# EAGLE design MAXboard_V2 (EAGLE 9.0.0)
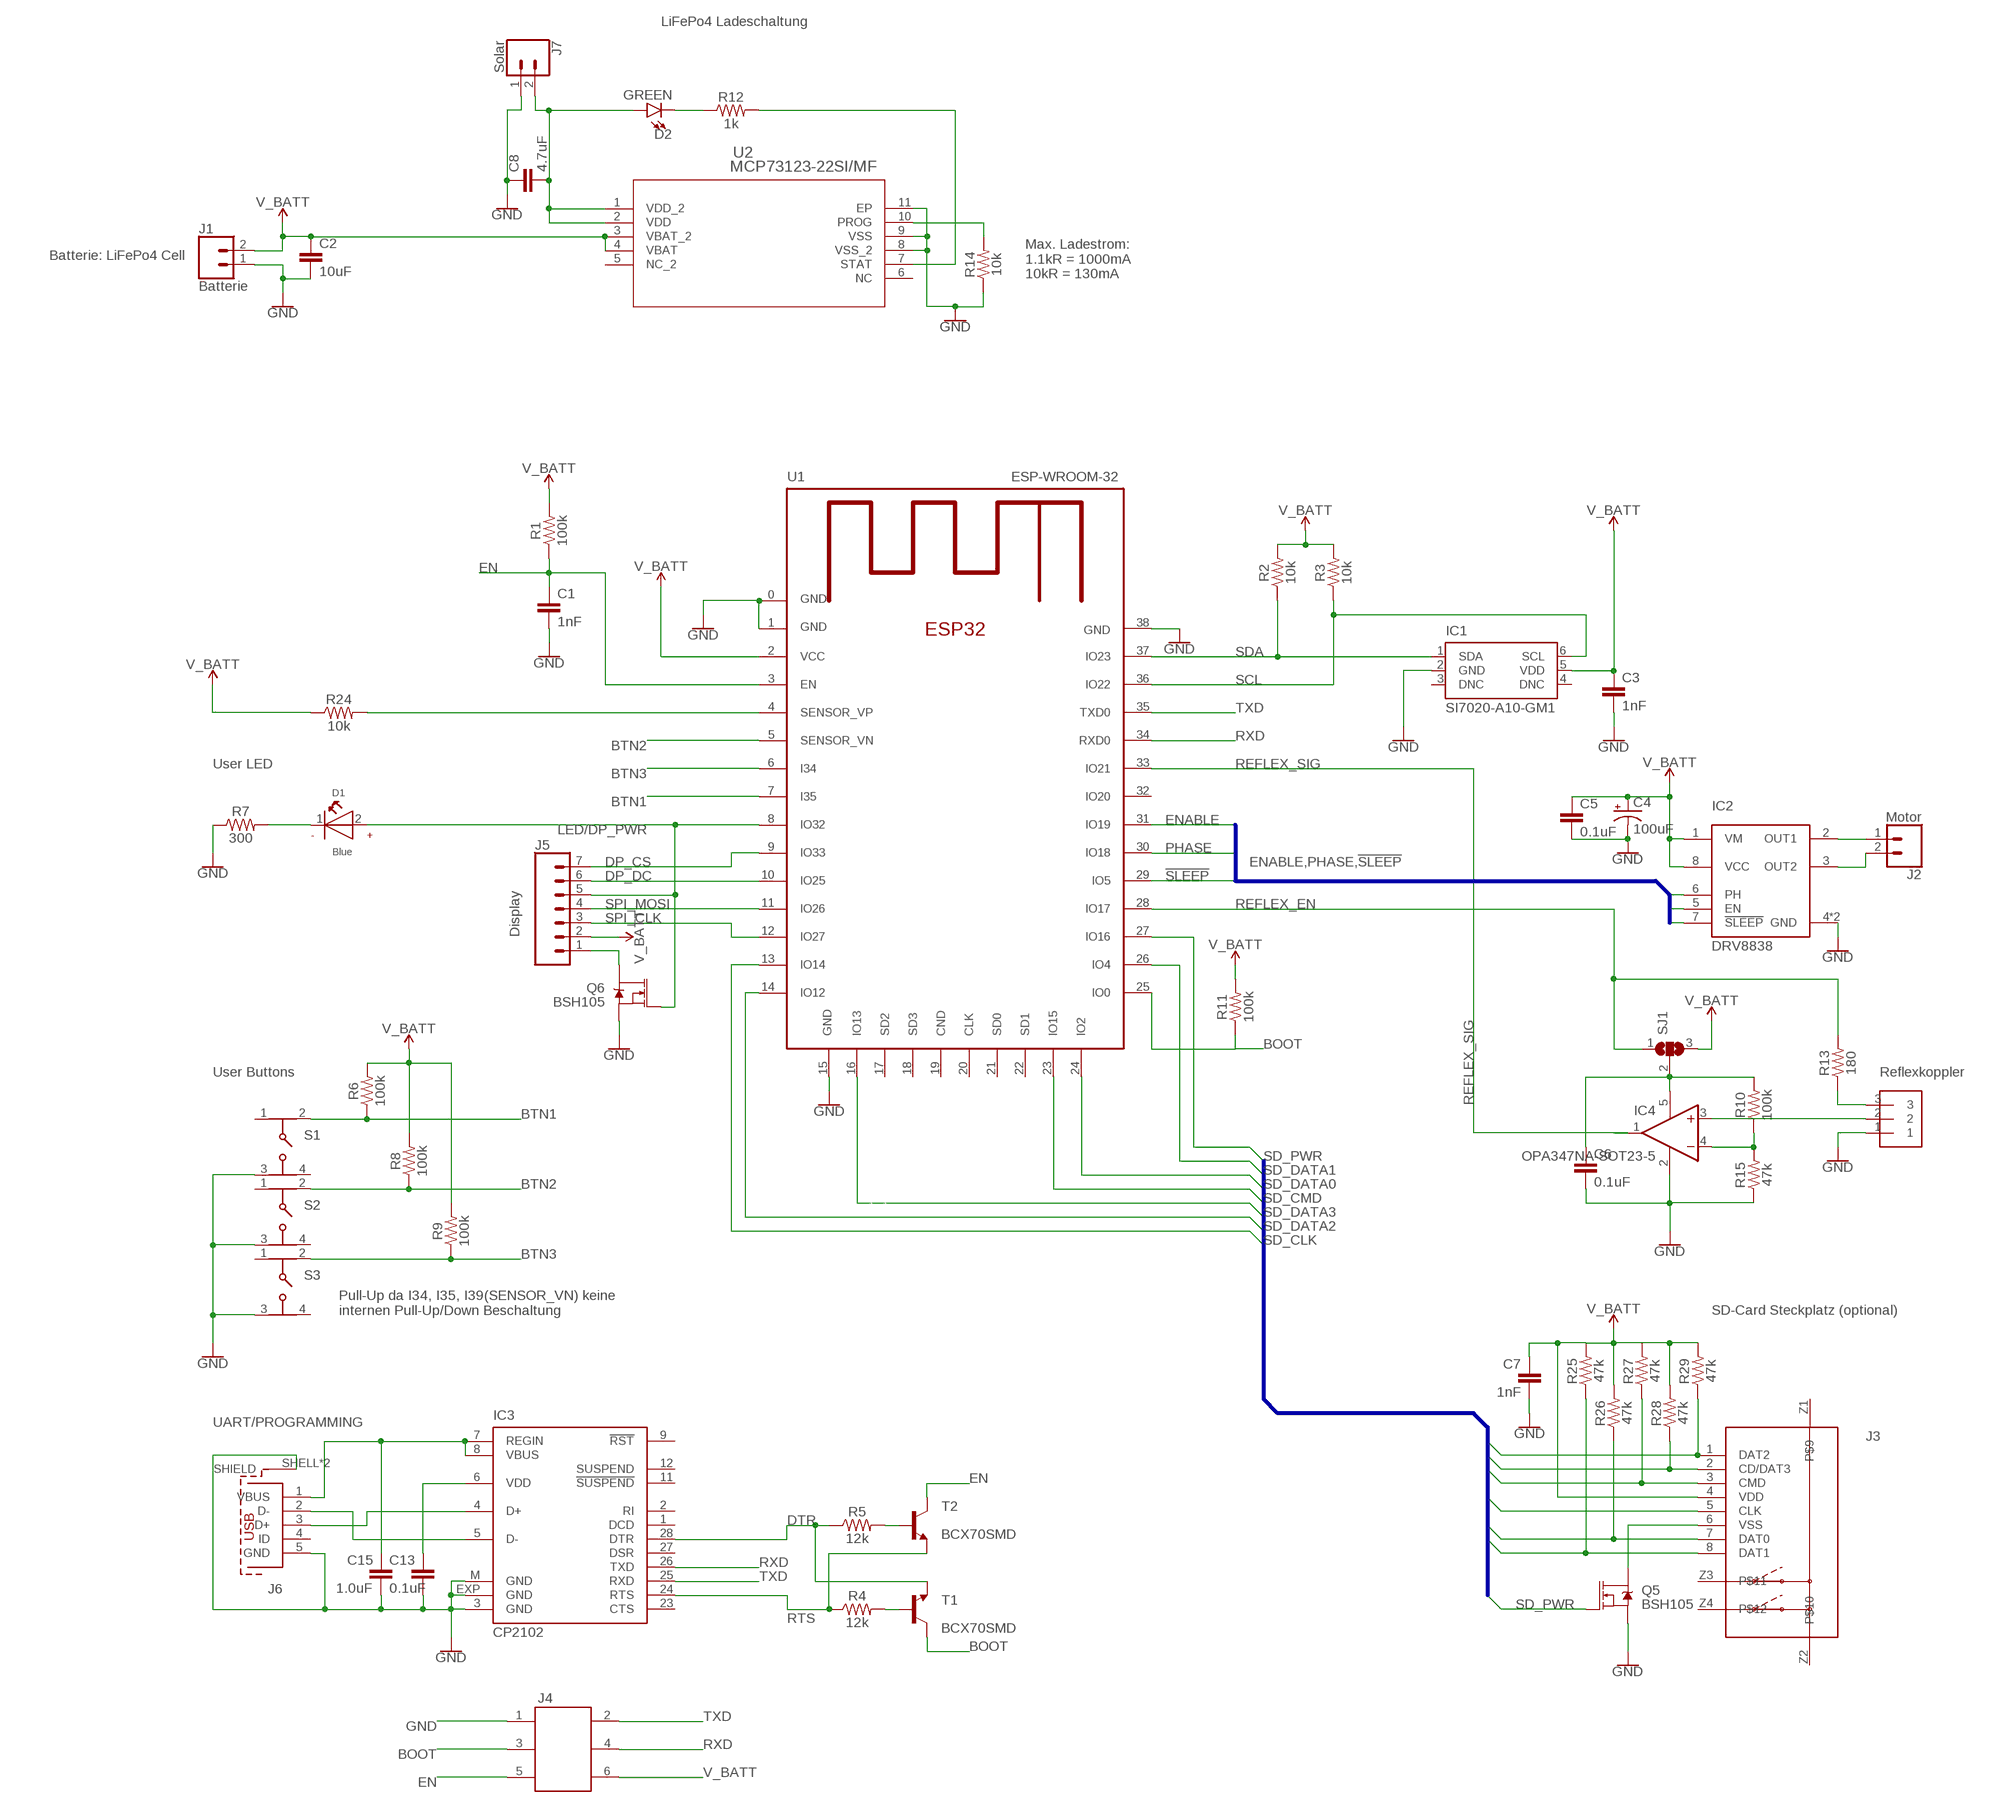
[diagram p0: schematic, sheet 1]

## Parts
C1  1nF  1.0NF/1000PF-0603-50V-10%  [0603]
C2  10uF  10UF-0603-6.3V-20%  [0603]
C3  1nF  1.0NF/1000PF-0603-50V-10%  [0603]
C4  100uF  100UF-POLAR-25V-20%(ELEC)  [PANASONIC_D]
C5  0.1uF  0.1UF-0603-25V-(+80/-20%)  [0603]
C6  0.1uF  0.1UF-0603-25V-(+80/-20%)  [0603]
C7  1nF  1.0NF/1000PF-0603-50V-10%  [0603]
C8  4.7uF  4.7UF0603  [0603]
C13  0.1uF  0.1UF-0603-25V-5%  [0603]
C15  1.0uF  1.0UF-0603-16V-10%  [0603]
D1  Blue  WL-SMCW-150060BS75000-B  [WL-SMCW_0603]
D2  GREEN  LED-GREEN0603  [LED-0603]
IC1  SI7020-A10-GM1  [DFN6-3X3]
IC2  DRV8838  [WSON8-2X2]
IC3  CP2102  [MLP28]
IC4  OPA347NA-SOT23-5  OPA344N-SOT23  [SOT23-5]
J1  Batterie  CONN_02  [1X02]
J2  Motor  CONN_02  [1X02]
J3  693072010801  [693072010801]
J4  490107670612  [490107670612]
J5  Display  CONN_07  [1X07]
J6  614105150721  [614105150721]
J7  Solar  CONN_02  [1X02]
Q5  BSH105  MOSFET-NCH-AO3404A  [SOT23-3]
Q6  BSH105  MOSFET-NCH-AO3404A  [SOT23-3]
R1  100k  100KOHM-0603-1/10W-1%  [0603]
R2  10k  10KOHM-0603-1/10W-1%  [0603]
R3  10k  10KOHM-0603-1/10W-1%  [0603]
R4  12k  12KOHM-0603-1/10W-1%  [0603]
R5  12k  12KOHM-0603-1/10W-1%  [0603]
R6  100k  100KOHM-0603-1/10W-1%  [0603]
R7  300  300OHM-0603-1/10W-1%  [0603]
R8  100k  100KOHM-0603-1/10W-1%  [0603]
R9  100k  100KOHM-0603-1/10W-1%  [0603]
R10  100k  100KOHM-0603-1/10W-1%  [0603]
R11  100k  100KOHM-0603-1/10W-1%  [0603]
R12  1k  1KOHM-0603-1/10W-1%  [0603]
R13  180  10OHM-0603-1/10W-1%  [0603]
R14  10k  10KOHM-0603-1/10W-1%  [0603]
R15  47k  47KOHM-0603-1/10W-1%  [0603]
R24  10k  10KOHM-0603-1/10W-1%  [0603]
R25  47k  47KOHM-0603-1/10W-1%  [0603]
R26  47k  47KOHM-0603-1/10W-1%  [0603]
R27  47k  47KOHM-0603-1/10W-1%  [0603]
R28  47k  47KOHM-0603-1/10W-1%  [0603]
R29  47k  47KOHM-0603-1/10W-1%  [0603]
S1  430181038816  [430181038816]
S2  430181038816  [430181038816]
S3  430181038816  [430181038816]
SJ1  SJ2W  [SJ_2]
T1  BCX70SMD  [SOT23]
T2  BCX70SMD  [SOT23]
U1  ESP-WROOM-32  ESP32MOD  [ESP32MOD]
U2  MCP73123-22SI/MF  [DFN10_3X3MC]
U$1  SMD_3  [SMD_3X1.28]

## Nets
!SLEEP: IC2.7(!SLEEP) U1.29(IO5)
BOOT: J4.3 R11.1 T1.3(C) U1.25(IO0)
BTN1: R6.1 S1.2 U1.7(I35)
BTN2: R8.1 S2.2 U1.5(SENSOR_VN)
BTN3: R9.1 S3.2 U1.6(I34)
DP_CS: J5.7 U1.9(IO33)
DP_DC: J5.6 U1.10(IO25)
DTR: IC3.28(DTR) R5.1 T1.2(E)
EN: C1.1 J4.5 R1.1 T2.3(C) U1.3(EN)
ENABLE: IC2.5(EN) U1.31(IO19)
GND: C1.2 C2.2 C3.2 C4.- C5.2 C6.2 C7.2 C8.1 C13.2 C15.2 IC1.2(GND) IC2.4(GND) IC2.EXP(GND) IC3.3(GND) IC3.EXP(GND) IC3.M(GND) IC4.2(V-) J1.1 J4.1 J6.5(GND) J6.SHELL1(SHIELD) J6.SHELL(SHIELD) J7.1 Q5.2(S) Q6.2(S) R7.1 R14.1 R15.1 S1.3 S2.3 S3.3 U1.0(GND) U1.1(GND) U1.15(GND) U1.38(GND) U2.8(VSS_2) U2.9(VSS) U2.11(EP) U$1.1
LED/DP_PWR: D1.2(+) J5.5 Q6.1(G) U1.8(IO32)
N$1: IC4.3(+IN) U$1.2
N$2: IC2.2(OUT1) J2.1
N$3: IC2.3(OUT2) J2.2
N$4: R24.2 U1.4(SENSOR_VP)
N$5: D1.1(-) R7.2
N$6: U1.16(IO13)
N$8: R13.1 U$1.3
N$9: C15.1 IC3.7(REGIN) IC3.8(VBUS) J6.1(VBUS)
N$10: IC3.5(D-) J6.2(D-)
N$12: IC3.4(D+) J6.3(D+)
N$13: J5.1 Q6.3(D)
N$14: C8.2 D2.A J7.2 U2.1(VDD_2) U2.2(VDD)
N$15: D2.C R12.1
N$16: R12.2 U2.7(STAT)
N$17: R14.2 U2.10(PROG)
N$18: J3.6(VSS) Q5.3(D)
N$19: IC4.4(-IN) R10.1 R15.2
N$22: C6.1 IC4.5(V+) R10.2 SJ1.2
N$23: R4.2 T1.1(B)
N$24: R5.2 T2.1(B)
N$25: C13.1 IC3.6(VDD)
PHASE: IC2.6(PH) U1.30(IO18)
REFLEX_EN: R13.2 SJ1.1 U1.28(IO17)
REFLEX_SIG: IC4.1(OUT) U1.33(IO21)
RTS: IC3.24(RTS) R4.1 T2.2(E)
RXD: IC3.26(TXD) J4.4 U1.34(RXD0)
SCL: IC1.6(SCL) R3.1 U1.36(IO22)
SD_CLK: J3.5(CLK) U1.13(IO14)
SD_CMD: J3.3(CMD) R27.1 U1.23(IO15)
SD_DATA0: J3.7(DAT0) R26.1 U1.24(IO2)
SD_DATA1: J3.8(DAT1) R25.1 U1.26(IO4)
SD_DATA2: J3.1(DAT2) R29.1 U1.14(IO12)
SD_DATA3: J3.2(CD/DAT3) R28.1
SD_PWR: Q5.1(G) U1.27(IO16)
SDA: IC1.1(SDA) R2.1 U1.37(IO23)
SPI_CLK: J5.3 U1.12(IO27)
SPI_MOSI: J5.4 U1.11(IO26)
TXD: IC3.25(RXD) J4.2 U1.35(TXD0)
V_BATT: C2.1 C3.1 C4.+ C5.1 C7.1 IC1.5(VDD) IC2.1(VM) IC2.8(VCC) J1.2 J3.4(VDD) J4.6 J5.2 R1.2 R2.2 R3.2 R6.2 R8.2 R9.2 R11.2 R24.1 R25.2 R26.2 R27.2 R28.2 R29.2 SJ1.3 U1.2(VCC) U2.3(VBAT_2) U2.4(VBAT)
Unconnected: IC1.3(DNC) IC1.4(DNC) IC3.1(DCD) IC3.2(RI) IC3.9(!RST) IC3.11(!SUSPEND) IC3.12(SUSPEND) IC3.23(CTS) IC3.27(DSR) J3.Z1 J3.Z2 J3.Z3 J3.Z4 J6.4(ID) S1.1 S1.4 S2.1 S2.4 S3.1 S3.4 U1.17(SD2) U1.18(SD3) U1.19(CND) U1.20(CLK) U1.21(SD0) U1.22(SD1) U1.32(IO20) U2.5(NC_2) U2.6(NC)

## Buses
ENABLE,PHASE,!SLEEP
SD_DATA[0..3],SD_CLK,SD_CMD,SD_PWR

## Notes on the sheet
- LiFePo4 Ladeschaltung
- Batterie: LiFePo4 Cell
- Max. Ladestrom:
  1.1kR = 1000mA
  10kR = 130mA
- User LED
- User Buttons | Reflexkoppler
- Pull-Up da I34, I35, I39(SENSOR_VN) keine
  internen Pull-Up/Down Beschaltung
- SD-Card Steckplatz (optional)
- UART/PROGRAMMING

## Library data of the parts
C1 C3 C7 = SparkFun-Capacitors:1.0NF/1000PF: 1nF/1,000pF ceramic capacitors A capacitor is a passive two-terminal electrical component used to store electrical energy temporarily in an electric field.; PROD_ID: CAP-07886
C2 = SparkFun-Capacitors:10UF: 10.0µF ceramic capacitors A capacitor is a passive two-terminal electrical component used to store electrical energy temporarily in an electric field.; PROD_ID: CAP-11015
C4 = SparkFun-Capacitors:100UF-POLAR: 100µF polarized capacitors A capacitor is a passive two-terminal electrical component used to store electrical energy temporarily in an electric field.; PROD_ID: CAP-12547
C5 C6 = SparkFun-Capacitors:0.1UF: 0.1µF ceramic capacitors A capacitor is a passive two-terminal electrical component used to store electrical energy temporarily in an electric field.; PROD_ID: CAP-00810
C8 = SparkFun-Capacitors:4.7UF: 4.7µF ceramic capacitors A capacitor is a passive two-terminal electrical component used to store electrical energy temporarily in an electric field.; PROD_ID: CAP-08280
C13 = SparkFun-Capacitors:0.1UF: 0.1µF ceramic capacitors A capacitor is a passive two-terminal electrical component used to store electrical energy temporarily in an electric field.; PROD_ID: CAP-08604
C15 = SparkFun-Capacitors:1.0UF: 1µF ceramic capacitors A capacitor is a passive two-terminal electrical component used to store electrical energy temporarily in an electric field.; PROD_ID: CAP-00868
D1 = EAGLE-COLOR_LED-rev17a:WL-SMCW: SMD mono-color Chip LED Characteristics Low energy consumption High reliability Low current requirement Fast switching No UV/IR radiation Smallest SMD package with exceptional brightness Top view Wide viewing angle PBC high-usage Applications Backlight for mobile and portable device keypads Indoor and outdoor message boards Flat backlight for LCDs, switches and symbols Display for industrial control systems and traffic Miniaturized color effects Pedestrian mark Optical indicators General lighting Toys <http://katalog.we-online.de/media/images/eipal/WL-SMCW_pf2.jpg> Details see: http://katalog.we-online.de/en/led/WL-SMCW?m Updated 2015-04-10 2015 (C) Wurth Elektronik; COMPANY-URL: http://www.we-online.de; CREATED-BY: Christin Otto; CREATED-DATE: APR 2013; DATASHEET-URL: http://katalog.we-online.de/en/led/WL-SMCW?m=t&sq=smcw&sp=&sp=http%3A%2F%2Fwww.we-online.de%2Fweb%2Fen%2Felectronic_components%2Fsearchpage_PBS.php%3Fsearch%3Dsmcw#vs_t2:2; MANUFACTURER: Würth Elektronik eiSos GmbH
D2 = SparkFun-LED:LED-GREEN: Green SMD LED Used in manufacturing of various products at SparkFun Packages: 0603 - SMD 0603 package [Product Link] <http://www.futureelectronics.com/en/technologies/semiconductors/optoelectronics/leds/Pages/9894312-LTST-C190GKT.aspx?CrossPart=HSMG-C190&IM=0> LilyPad 1206 - SMD1206 LilyPad package [Product Link] <http://www.futureelectronics.com/en/Technologies/Product.aspx?ProductID=IN150NGHARVATEKCORPORATION2049943&IM=0> 1206 - SMD1206 package [Product Link] <http://www.futureelectronics.com/en/technologies/semiconductors/optoelectronics/leds/Pages/8315665-LTST-C150KGKT.aspx?IM=0> 1206 Bottom Mount -SMD 1206 Bottom Mount [Product Link] <http://www.digikey.com/product-detail/en/lite-on-inc/LTST-C230KGKT/160-1456-1-ND/386854> SparkFun Products: Pro Mini 328 -5V <https://www.sparkfun.com/products/821> RedBoard <https://www.sparkfun.com/products/12757> MP3 Trigger <https://www.sparkfun.com/products/13720> Makey Makey <https://www.sparkfun.com/products/11076>; PROD_ID: DIO-00821
IC1 = si70xx-10:SI7020-*: I2C Humidity and Temperature Sensor Source: http://www.silabs.com/Support%20Documents/TechnicalDocs/Si7020.pdf; MF: Silicon Labs; MPN: Si7020-GM1; OC_FARNELL: 2422565; OC_NEWARK: 55X3108
IC2 = drv88xx:DRV8838
IC3 = silabs:CP210*: Single-Chip USB to UART Bridge Source: www.silabs.com .. CP2101.pdf / cp2102.pdf; MF: FARNELL; MPN: CP2102-GM; OC_FARNELL: 9282130; OC_NEWARK: 30K5635
IC4 = linear:OPA*-SOT23: Single Operational Amplifier Low Power, Single-Supply, Rail-To-Rail Operational Amplifier Source: http://focus.ti.com/lit/ds/symlink/opa2345.pdf
J1 J2 J7 = SparkFun-Connectors:CONN_02: Multi connection point. Often used as Generic Header-pin footprint for 0.1 inch spaced/style header connections On any of the 0.1 inch spaced packages, you can populate with these: Break Away Headers - Straight <https://www.sparkfun.com/products/116> (PRT-00116) Break Away Male Headers - Right Angle <https://www.sparkfun.com/products/553> (PRT-00553) Female Headers <https://www.sparkfun.com/products/115> (PRT-00115) Break Away Headers - Machine Pin <https://www.sparkfun.com/products/117> (PRT-00117) Break Away Female Headers - Swiss Machine Pin <https://www.sparkfun.com/products/743> (PRT-00743) For SCREWTERMINALS and SPRING TERMINALS visit here: Screw Terimnals on SparkFun.com <https://www.sparkfun.com/search/results?term=Screw+Terminals> (5mm/3.5mm/2.54mm spacing) This device is also useful as a general connection point to wire up your design to another part of your project. Our various solder wires solder well into these plated through hole pads. Hook-Up Wire - Assortment (Stranded, 22 AWG) <https://www.sparkfun.com/products/11375> (PRT-11375) Hook-Up Wire - Assortment (Solid Core, 22 AWG) <https://www.sparkfun.com/products/11367> (PRT-11367) View the entire wire category on our website here <https://www.sparkfun.com/categories/141> Special notes: Molex polarized connector foot print use with: PRT-08233 with associated crimp pins and housings. 2.54_SCREWTERM for use with PRT-10571. 3.5mm Screw Terminal footprints for PRT-08084 5mm Screw Terminal footprints for use with PRT-08432
J3 = EAGLE-INPUT_OUTPUT_CONNECTORS-rev17a:693072010801: WR-CRD MICRO SD CARD CONNECTOR HINGE 8PINS=>Code : Con_I-O_COM_CRD_SD_Micro_696072010801 <http://katalog.we-online.de/media/images/eican/Con_I-O_COM_CRD_SD_Micro_696072010801_pf2.jpg> Details see: http://katalog.we-online.de/en/em/CRD_SD_MICRO_HINGEL_8_PINS/693072010801 Created 2014-07-09, Karrer Zheng 2014 (C) Würth Elektronik
J4 = Wire-to-Board (rev17b):490107670612: WR-WST REDFIT IDC, 6 Pins
J5 = SparkFun-Connectors:CONN_07: Multi connection point. Often used as Generic Header-pin footprint for 0.1 inch spaced/style header connections On any of the 0.1 inch spaced packages, you can populate with these: Break Away Headers - Straight <https://www.sparkfun.com/products/116> (PRT-00116) Break Away Male Headers - Right Angle <https://www.sparkfun.com/products/553> (PRT-00553) Female Headers <https://www.sparkfun.com/products/115> (PRT-00115) Break Away Headers - Machine Pin <https://www.sparkfun.com/products/117> (PRT-00117) Break Away Female Headers - Swiss Machine Pin <https://www.sparkfun.com/products/743> (PRT-00743) For SCREWTERMINALS and SPRING TERMINALS visit here: Screw Terimnals on SparkFun.com <https://www.sparkfun.com/search/results?term=Screw+Terminals> (5mm/3.5mm/2.54mm spacing) This device is also useful as a general connection point to wire up your design to another part of your project. Our various solder wires solder well into these plated through hole pads. Hook-Up Wire - Assortment (Stranded, 22 AWG) <https://www.sparkfun.com/products/11375> (PRT-11375) Hook-Up Wire - Assortment (Solid Core, 22 AWG) <https://www.sparkfun.com/products/11367> (PRT-11367) View the entire wire category on our website here <https://www.sparkfun.com/categories/141> Special notes: Molex polarized connector foot print use with SKU : PRT-08231 with associated crimp pins and housings. 1MM SMD Version SKU: PRT-10208 NOTES ON THE VARIANTS LOCK and LOCK_LONGPADS... This footprint was designed to help hold the alignment of a through-hole component (i.e. 6-pin header) while soldering it into place. You may notice that each hole has been shifted either up or down by 0.005 of an inch from it's more standard position (which is a perfectly straight line). This slight alteration caused the pins (the squares in the middle) to touch the edges of the holes. Because they are alternating, it causes a "brace" to hold the component in place. 0.005 has proven to be the perfect amount of "off-center" position when using our standard breakaway headers. Although looks a little odd when you look at the bare footprint, once you have a header in there, the alteration is very hard to notice. Also,if you push a header all the way into place, it is covered up entirely on the bottom side.
J6 = EAGLE-INPUT_OUTPUT_CONNECTORS-rev17a:614105150721: WR-COM_USB_Micro Type B_Vertical_THT; Micro Type B Vertical THT- Tape & Reel not for Pick & Place machine Code : Con_I-O_COM_USB_2.0_B_614105150721_614105150721 <http://katalog.we-online.de/media/images/eican/Con_I-O_COM_USB_2.0_B_614105150721_pf2.jpg> Details see: http://katalog.we-online.de/em/datasheet/614105150721.pdf Created 12/08/2014, Dan Xu 2014 (C) Wurth Elektronik
Q5 Q6 = SparkFun-DiscreteSemi:MOSFET-NCH: N-channel MOSFETs Voltage controlled devices that allow control of high current outputs. SparkFun Products: SparkFun OpenScale <https://www.sparkfun.com/products/13261> SparkFun Digital Sandbox <https://www.sparkfun.com/products/12651> SparkFun Monster Moto Shield <https://www.sparkfun.com/products/10182> SparkFun MOSFET Power Controller <https://www.sparkfun.com/products/11214>; PROD_ID: TRANS-12988; VALUE: 5.8A/30V/35mΩ
R1 R6 R8-R11 = SparkFun-Resistors:100KOHM: 100kΩ resistor A resistor is a passive two-terminal electrical component that implements electrical resistance as a circuit element. Resistors act to reduce current flow, and, at the same time, act to lower voltage levels within circuits. - Wikipedia; PROD_ID: RES-07828
R2 R3 R14 R24 = SparkFun-Resistors:10KOHM: 10kΩ resistor A resistor is a passive two-terminal electrical component that implements electrical resistance as a circuit element. Resistors act to reduce current flow, and, at the same time, act to lower voltage levels within circuits. - Wikipedia; PROD_ID: RES-00824
R4 R5 = SparkFun-Resistors:12KOHM: 12kΩ resistor A resistor is a passive two-terminal electrical component that implements electrical resistance as a circuit element. Resistors act to reduce current flow, and, at the same time, act to lower voltage levels within circuits. - Wikipedia; PROD_ID: RES-10327
R7 = SparkFun-Resistors:300OHM: 300Ω resistor A resistor is a passive two-terminal electrical component that implements electrical resistance as a circuit element. Resistors act to reduce current flow, and, at the same time, act to lower voltage levels within circuits. - Wikipedia; PROD_ID: RES_10328
R12 = SparkFun-Resistors:1KOHM: 1kΩ resistor A resistor is a passive two-terminal electrical component that implements electrical resistance as a circuit element. Resistors act to reduce current flow, and, at the same time, act to lower voltage levels within circuits. - Wikipedia; PROD_ID: RES-07856
R13 = SparkFun-Resistors:10OHM: 10Ω resistor A resistor is a passive two-terminal electrical component that implements electrical resistance as a circuit element. Resistors act to reduce current flow, and, at the same time, act to lower voltage levels within circuits. - Wikipedia; PROD_ID: RES-12581; VALUE: 10
R15 R25-R29 = SparkFun-Resistors:47KOHM: 47kΩ resistor A resistor is a passive two-terminal electrical component that implements electrical resistance as a circuit element. Resistors act to reduce current flow, and, at the same time, act to lower voltage levels within circuits. - Wikipedia; PROD_ID: RES-07871
S1-S3 = EAGLE-TACT_SWITCHES-rev16e:430181038816: 4.5x4.5 mm SMD WS-TASV <http://katalog.we-online.de/media/images/v2/Family_WS-TASV_SMD_Tact_Switch_430181038816.jpg> Details see: http://katalog.we-online.de/en/em/TASV_4_5X4_5_SMD/430181038816
SJ1 = jumper:SJ2W: SMD solder JUMPER
T1 T2 = transistor:BCX70SMD: NPN TRANSISTOR
U1 = ESP3x:ESP32MOD: ESP32 Module Espressif
U2 = mcp73123lbr:MCP73123-22SI/MF; MANUFACTURER_PART_NUMBER: MCP7312322SIMF; VENDOR: Microchip
U$1 = generic:SMD_3

## Board
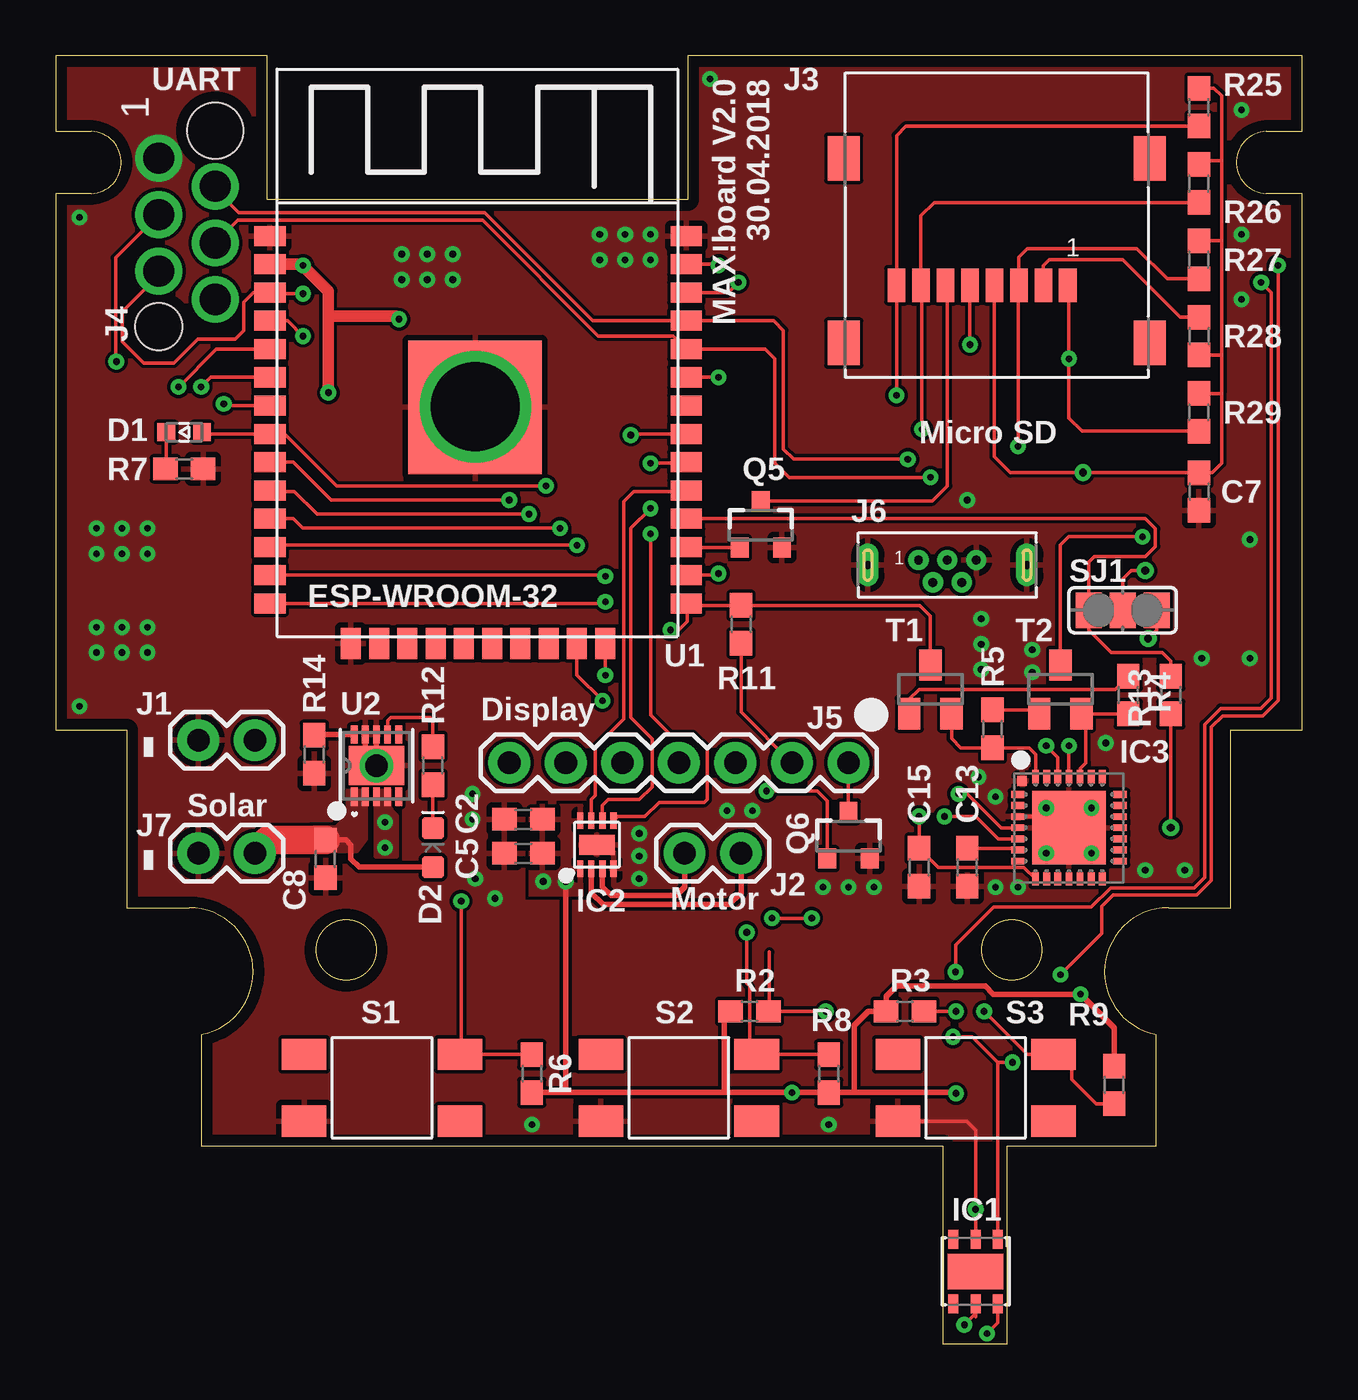
[diagram p1: board, top side]
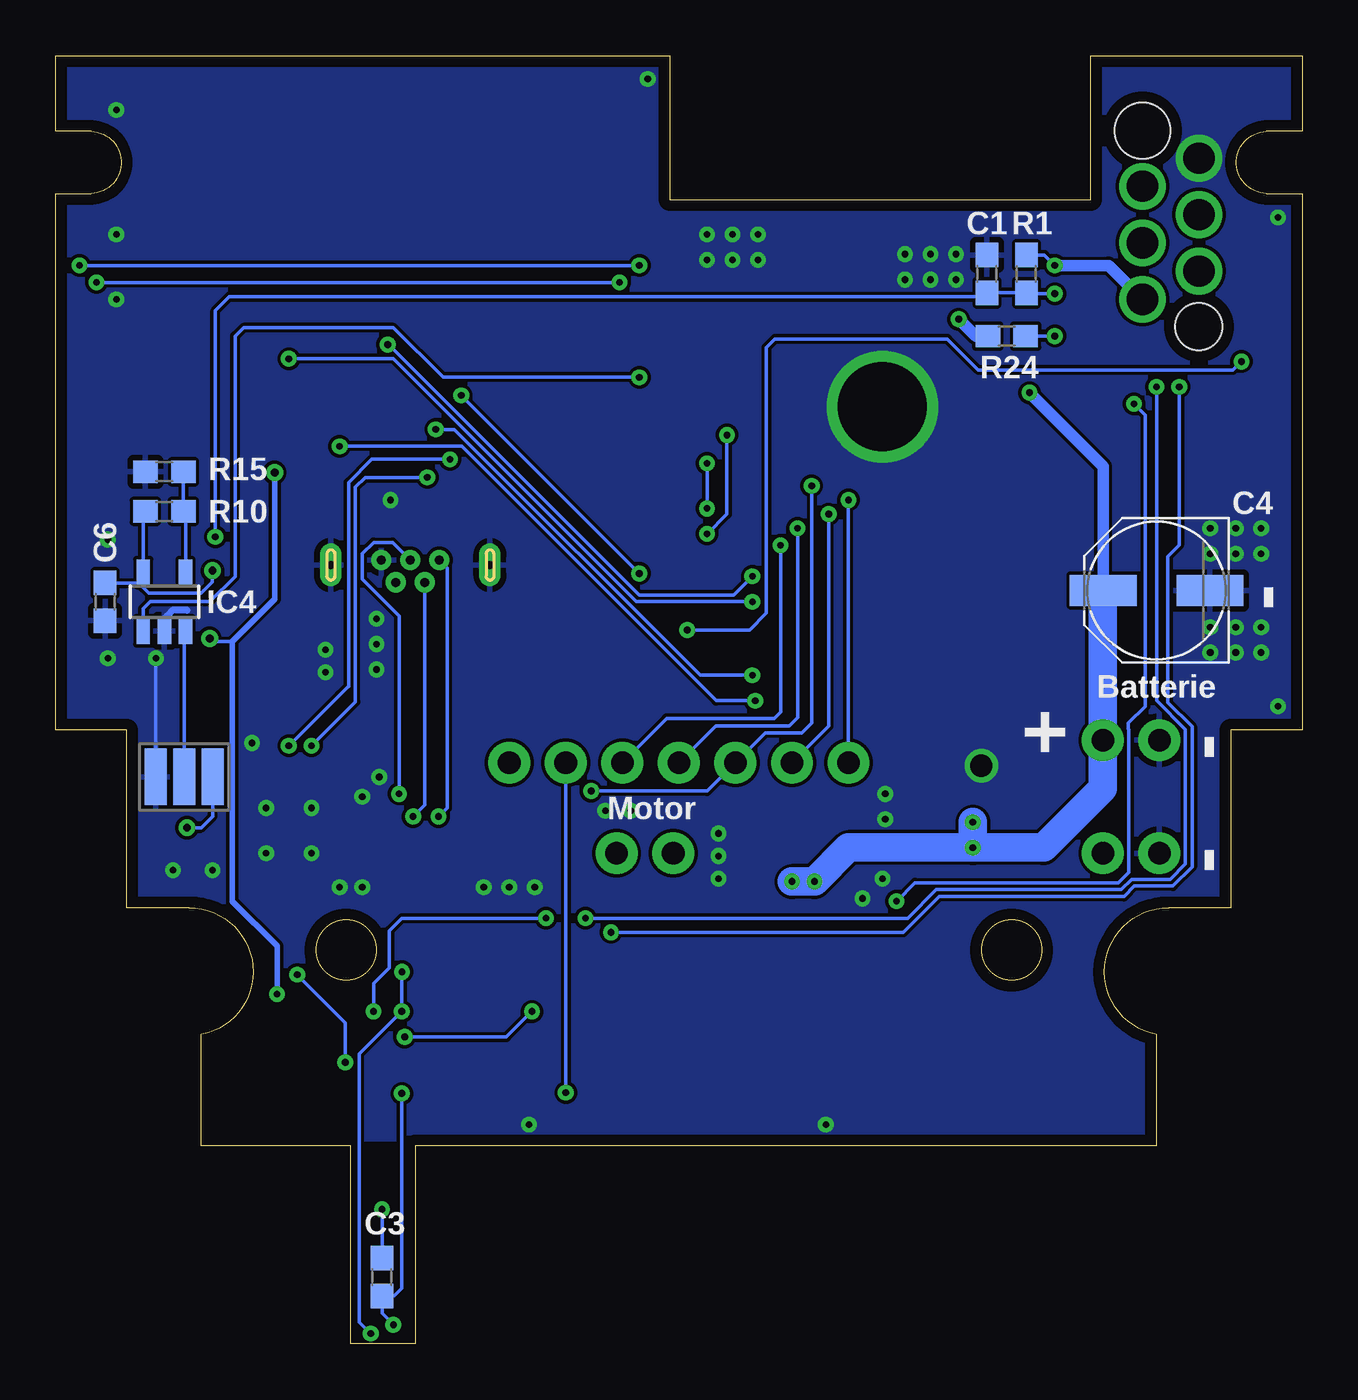
[diagram p2: board, bottom side, seen from below]

Size 56 x 57.9 mm. Coordinates in mm from the lower left corner, seen from the top.
Outline: 42.75,8.9 49.45,8.9 49.45,13.9 arc-169 50,19.6 52.8,19.6 52.8,27.6 56,27.6 56,51.7 54.4,51.7 arc-176 54.4,54.5 56,54.5 56,57.9 28.4,57.9 28.4,51.43 9.5,51.43 9.5,57.9 0,57.9 0,54.5 1.6,54.5 arc-176 1.6,51.7 0,51.7 0,27.6 3.2,27.6 3.2,19.6 6,19.6 arc-169 6.55,13.9 6.55,8.9 39.85,8.9 39.85,0 42.75,0 42.75,8.9
Outline: circle at 42.95,17.7 radius 1.35
Outline: circle at 13.05,17.7 radius 1.35
Copper layers (1*16): Top 0.035mm / dielectric 1.5mm / Bottom 0.035mm
Design rules "MAXboard *": minimum track width 6mil, minimum drill 0.3mm, track to track 6mil, track to pad 6mil, pad to pad 6mil, via to via 6mil, smd to smd 6mil, copper to edge 20mil, drill to drill 10mil, minimum pad ring 10mil, minimum via ring 8mil, stop-mask expansion 4mil, vias tented up to drill 0mil, thermal gap 10mil

### Footprints (pad centres in the part's own frame; a part is rotated, then mirrored left to right if it is on the bottom)
0603 = smd 1.1 x 1: 1 -0.85,0; 2 0.85,0
PANASONIC_D = smd 3 x 1.4: + 2.4,0; - -2.4,0
WL-SMCW_0603 = smd 0.8 x 0.8: 1 -0.8,0; 2 0.8,0
LED-0603 = smd 1 x 1: A -0.877,0; C 0.877,0
DFN6-3X3 = smd 0.85 x 0.45: 1 -1.45,1; 2 -1.45,0; 3 -1.45,-1; 4 1.45,-1; 5 1.45,0; 6 1.45,1 | smd 1.6 x 2.5: EXP 0,0
WSON8-2X2 = smd 0.28 x 0.75: 1 -0.75,-1.075; 2 -0.25,-1.075; 3 0.25,-1.075; 4 0.75,-1.075; 5 0.75,1.075; 6 0.25,1.075; 7 -0.25,1.075; 8 -0.75,1.075 | smd 1.6 x 0.9: EXP 0,0
MLP28 = smd 0.6 x 0.3: 1 -2.3,1.5; 2 -2.3,1; 3 -2.3,0.5; 4 -2.3,0; 5 -2.3,-0.5; 6 -2.3,-1; 7 -2.3,-1.5; 15 2.3,-1.5; 16 2.3,-1; 17 2.3,-0.5; 18 2.3,0; 19 2.3,0.5; 20 2.3,1; 21 2.3,1.5 | smd 0.3 x 0.6: 8 -1.5,-2.3; 9 -1,-2.3; 10 -0.5,-2.3; 11 0,-2.3; 12 0.5,-2.3; 13 1,-2.3; 14 1.5,-2.3; 22 1.5,2.3; 23 1,2.3; 24 0.5,2.3; 25 0,2.3; 26 -0.5,2.3; 27 -1,2.3; 28 -1.5,2.3 | smd 3.3 x 3.3: EXP 0,0 | smd 0.435 x 0.435: M -2.103,2.103
SOT23-5 = smd 0.6 x 1.2: 1 -0.95,-1.306; 2 0,-1.306; 3 0.95,-1.306; 4 0.95,1.306; 5 -0.95,1.306
1X02 = drill 1.016 pad 1.88: 1 0,0; 2 2.54,0
693072010801 = smd 0.8 x 1.5: 1 7.7,0; 2 6.6,0; 3 5.5,0; 4 4.4,0; 5 3.3,0; 6 2.2,0; 7 1.1,0; 8 0,0 | smd 1.45 x 2: Z1 -2.375,5.7; Z2 11.375,5.7; Z3 -2.375,-2.6; Z4 11.375,-2.6
490107670612 = drill 1.4 pad 1.8: 1 -2.54,-1.27; 2 -3.81,-3.81; 3 -5.08,-1.27; 4 -6.35,-3.81; 5 -7.62,-1.27; 6 -8.89,-3.81 | hole 2.1: -10.12,-1.27 | hole 2.5: -1.31,-3.81
1X07 = drill 1.016 pad 1.88: 1 0,0; 2 2.54,0; 3 5.08,0; 4 7.62,0; 5 10.16,0; 6 12.7,0; 7 15.24,0
614105150721 = drill 0.4: 1 -1.3,0.22; 2 -0.65,-0.78; 3 0,0.22; 4 0.65,-0.78; 5 1.3,0.22 | drill 0.35 pad 0.97 long: SHELL -3.575,0; SHELL1 3.575,0
SOT23-3 = smd 0.8 x 0.9: 1 -0.95,-1; 2 0.95,-1; 3 0,1.1
430181038816 = smd 2 x 1.4: 1 -3.5,1.5; 2 3.5,1.5; 3 -3.5,-1.5; 4 3.5,-1.5
SJ_2 = smd 1.168 x 1.6: 1 -1.524,0; 2 0,0; 3 1.524,0
SOT23 = smd 1 x 1.4: 1 -0.95,-1.1; 2 0.95,-1.1; 3 0,1.1
ESP32MOD = smd 6 x 6: 0 9.9,12.3 | smd 1.4 x 0.9: 1 0.68,19.99; 2 0.68,18.72; 3 0.68,17.45; 4 0.68,16.18; 5 0.68,14.91; 6 0.68,13.64; 7 0.68,12.37; 8 0.68,11.1; 9 0.68,9.83; 10 0.68,8.56; 11 0.68,7.29; 12 0.68,6.02; 13 0.68,4.75; 14 0.68,3.48; 25 19.38,3.48; 26 19.38,4.75; 27 19.38,6.02; 28 19.38,7.29; 29 19.38,8.56; 30 19.38,9.83; 31 19.38,11.1; 32 19.38,12.37; 33 19.38,13.64; 34 19.38,14.91; 35 19.38,16.18; 36 19.38,17.45; 37 19.38,18.72; 38 19.38,19.99 | smd 0.9 x 1.4: 15 4.31,1.68; 16 5.58,1.68; 17 6.85,1.68; 18 8.12,1.68; 19 9.39,1.68; 20 10.66,1.68; 21 11.93,1.68; 22 13.2,1.68; 23 14.47,1.68; 24 15.74,1.68
DFN10_3X3MC = smd 0.813 x 0.305: 1 -1.397,1; 2 -1.397,0.5; 3 -1.397,0; 4 -1.397,-0.5; 5 -1.397,-1; 6 1.397,-1; 7 1.397,-0.5; 8 1.397,0; 9 1.397,0.5; 10 1.397,1 | smd 1.753 x 2.489: 11 0,0
SMD_3X1.28 = smd 1 x 2.54: 1 -1.28,0; 2 0,0; 3 1.28,0

### Placement (x,y rotation side)
C1  14.16,48.09 90 bottom
C2  21.02,23.58 180 top
C3  41.34,3 90 bottom
C4  6.54,33.86 180 bottom
C5  21.02,22.05 180 top
C6  53.78,33.36 270 bottom
C7  51.37,38.31 270 top
C8  12.12,21.8 90 top
C13  40.95,21.42 270 top
C15  38.8,21.42 270 top
D1  5.77,40.98 0 top
D2  16.95,22.31 90 top
IC1  41.34,3.26 270 top
IC2  24.32,22.43 0 top
IC3  45.53,23.2 0 top
IC4  51.11,33.36 0 bottom
J1  6.41,27.13 0 top
J2  30.79,22.05 180 top
J3  37.78,47.58 0 top
J4  3.36,55.83 90 top
J5  35.62,26.12 180 top
J6  40.06,35.01 0 top
J7  6.41,22.05 0 top
Q5  31.68,36.78 0 top
Q6  35.62,22.81 0 top
R1  12.38,48.09 90 bottom
R2  31.18,14.94 180 top
R3  38.16,14.94 180 top
R4  48.19,29.16 90 top
R5  42.1,27.64 90 top
R6  21.4,12.15 270 top
R7  5.77,39.32 180 top
R8  34.73,12.15 270 top
R9  47.56,11.64 90 top
R10  51.11,37.42 180 bottom
R11  30.79,32.34 270 top
R12  16.95,25.99 90 top
R13  50.1,29.16 90 top
R14  11.62,26.5 90 top
R15  51.11,39.2 0 bottom
R24  13.27,45.29 0 bottom
R25  51.37,55.58 90 top
R26  51.37,52.15 90 top
R27  51.37,48.72 90 top
R28  51.37,45.29 270 top
R29  51.37,41.86 90 top
S1  14.66,11.51 0 top
S2  28,11.51 0 top
S3  41.34,11.51 0 top
SJ1  47.94,32.97 0 top
T1  39.3,29.42 0 top
T2  45.14,29.42 0 top
U1  8.95,29.8 0 top
U2  14.41,25.99 90 top
U$1  50.23,25.48 0 bottom

### Tracks (layer width: path | path; a pad name or v marks a point on that pad's centre or on a via)
!SLEEP
  Top 0.152: IC2.7 24.07,24.47 24.25,24.65 24.25,26.82 25.52,28.09 25.52,37.86 25.97,38.31 28.28,38.31 U1.29
BOOT  (via drill 0.3)
  Top 0.152: 28.96,33.28 U1.25 28.38,33.23 | 28.38,33.23 28.42,33.19 R11.1 38.83,33.19 39.3,32.72 T1.3 | J4.3 2.69,48.82 2.69,44.18 v2.73,44.15 | v27.62,32.09 28,32.09 28.38,32.47 28.38,33.23
  Bottom 0.152: v2.73,44.15 3.11,43.77 14.54,43.77 15.94,45.17 23.68,45.17 24.06,44.79 24.06,32.85 24.82,32.09 v27.62,32.09
BTN1  (via drill 0.3)
  Top 0.152: S1.2 18.48,13.01 | 18.48,13.01 21.38,13.01 R6.1 | U1.7 7.63,42.17 v7.55,42.25 | v18.22,19.89 18.22,13.27 18.48,13.01
  Bottom 0.152: v7.55,42.25 7.05,41.74 7.05,28.66 7.81,27.89 7.81,27.64 7.78,27.62 7.78,21.19 8.25,20.72 17.4,20.72 v18.22,19.89
BTN2  (via drill 0.3)
  Top 0.152: R8.1 34.72,13.01 S2.2 31.18,13.34 31.18,16.08 31.05,16.21 v31.05,18.5 | U1.5 7.22,44.71 v5.52,43.01
  Bottom 0.152: v5.52,43.01 5.52,35.9 6.03,35.39 6.03,28.83 4.94,27.74 4.94,21.44 5.8,20.58 7.53,20.58 8,20.11 16.3,20.11 17.92,18.5 v31.05,18.5
BTN3  (via drill 0.3)
  Top 0.152: R9.1 46.76,10.79 45.65,11.89 45.65,12.65 45.3,13.01 S3.2 43.64,13.01 v41.72,14.94 | U1.6 6.97,43.44 v6.54,43.01 | v32.19,19.13 v33.97,19.13
  Bottom 0.152: v6.54,43.01 6.54,28.91 5.24,27.62 5.24,21.57 5.93,20.88 7.66,20.88 8.12,20.41 16.43,20.41 17.71,19.13 v32.19,19.13 | v33.97,19.13 40.45,19.13 41.02,18.56 41.02,16.9 41.72,16.2 v41.72,14.94
DP_CS  (via drill 0.3)
  Top 0.152: U1.9 10.68,39.63 12.38,37.93 v20.38,37.93
  Bottom 0.152: J5.7 v20.38,37.93
DP_DC  (via drill 0.3)
  Top 0.152: v21.27,37.29 11.74,37.29 10.73,38.31 9.68,38.31 U1.10
  Bottom 0.152: J5.6 21.27,27.77 v21.27,37.29
DTR
  Top 0.152: T1.2 40.25,27.2 40.66,26.79 R5.1 43.73,26.79 44.03,26.5 IC3.28
EN  (via drill 0.3)
  Top 0.152: v11.11,47.2 9.68,47.2 U1.3 8.87,47.25 8.45,46.83 8.45,46.41 8.44,46.41 8.44,45.55 8.06,45.17 6.39,45.17 5.31,44.08 3.95,44.08 3,45.04 3,46.39 4.63,48.03 J4.5 | T2.3 45.14,35.9 45.53,36.28 v48.83,36.28
  Bottom 0.152: v11.11,47.2 12.34,47.2 R1.1 C1.1 14.32,47.07 48.19,47.07 48.83,46.44 v48.83,36.28
ENABLE  (via drill 0.3)
  Top 0.152: IC2.5 25.26,23.7 26.48,23.7 27.11,24.34 29.14,24.34 29.27,24.47 29.27,26.75 28.64,27.39 27.62,27.39 26.73,28.28 v26.73,36.4 | U1.31 25.89,40.9 v25.84,40.85
  Bottom 0.152: v25.84,40.85 25.84,37.29 v26.73,36.4
GND  (via drill 0.3, 1, 4)
  Top 0.152: IC1.2 v41.34,6.05 41.34,9.61 40.93,10.01 S3.3 | 44.7,23.89 45.4,23.2 IC3.EXP 45.03,23.7 IC3.3 | 44.7,23.89 v44.51,24.08 | 43.75,23.7 IC3.3 | IC3.3 44.5,23.7 44.7,23.89 | 13.91,26.24 13.91,26.12 13.9,26.12
  Top 0.254: U2.9 13.91,26.24 | U2.8 U2.11
  Bottom 0.152: v41.34,6.05 C3.2 | 51.05,32.66 50.99,32.72 | v51.5,30.82 51.5,25.49 U$1.1
  Bottom 0.305: IC4.2 51.05,32.11 51.05,32.66 | 50.1,32.97 50.73,32.97 50.99,32.72
  other vias: 14.41,25.99 18.86,42.12 34.73,9.86 21.4,9.86 53.65,36.15 15.55,48.98 16.7,48.98 17.84,48.98 15.55,47.83 16.7,47.83 17.84,47.83 24.44,49.87 25.59,48.72 24.44,48.72 26.73,48.72 26.73,49.87 25.59,49.87 4.12,35.51 2.98,35.51 1.84,35.51 1.84,36.66 2.98,36.66 4.12,36.66 4.12,32.21 2.98,32.21 1.84,32.21 1.84,31.07 2.98,31.07 4.12,31.07 46.54,24.08 46.54,22.05 44.51,22.05 42.22,24.59 41.46,25.48 41.59,30.31 41.59,31.45 41.59,32.59 43.24,20.53 42.22,20.53 36.76,20.53 35.62,20.53 34.48,20.53 30.16,23.96 31.3,23.96 26.22,22.94 26.22,20.91 26.22,21.93 18.73,23.58 18.73,24.72 18.86,20.91 19.74,20.02 53.65,30.82 40.95,37.93 53.27,46.94 53.27,49.87 53.27,55.45 29.4,56.85 1.08,50.63 1.08,28.66 43.88,30.18 43.88,31.2 48.95,21.29 50.73,21.29 47.18,27.01
  pour Top (rank 6): 9.2,57.61 9.2,51.26 28.64,51.26 28.64,57.61 55.69,57.61 55.69,27.89 49.21,9.23 6.92,9.23 0.31,27.89 0.31,57.61
  pour Bottom (rank 6): 9.2,57.61 9.2,51.26 28.64,51.26 28.64,57.61 55.69,57.61 55.69,27.89 49.21,9.23 6.79,9.23 0.31,27.89 0.31,57.61
LED/DP_PWR  (via drill 0.3)
  Top 0.152: D1.2 6.65,40.9 U1.8 10.3,40.9 12.63,38.56 v22.03,38.56 | Q6.1 34.67,24.4 34.22,24.85 v31.94,24.85
  Bottom 0.152: v31.94,24.85 26.73,24.85 J5.5 24.13,27.45 22.48,27.45 22.03,27.89 v22.03,38.56
N$1
  Bottom 0.152: IC4.3 50.23,31.99 U$1.2
N$2
  Top 0.254: IC2.2 24.07,20.27 24.6,19.74 30.26,19.74 30.79,20.27 J2.1
N$3
  Top 0.254: IC2.3 24.57,20.53 24.95,20.15 27.87,20.15 28.25,20.53 J2.2
N$4  (via drill 0.3)
  Top 0.152: v11.11,45.29 10.42,45.98 U1.4
  Bottom 0.152: R24.2 v11.11,45.29
N$5
  Top 0.152: D1.1 4.98,39.37 R7.2
N$8  (via drill 0.35)
  Top 0.152: R13.1 v50.1,23.2
  Bottom 0.152: v50.1,23.2 49.46,23.2 48.95,23.71 U$1.3
N$9  (via drill 0.3)
  Top 0.152: IC3.7 42.95,21.42 | 42.95,21.42 39.64,21.42 C15.1 v38.8,23.7 | 42.95,21.42 43.5,21.42 IC3.8
  Bottom 0.152: v38.8,23.7 38.41,24.08 38.41,34.88 J6.1
N$10  (via drill 0.3)
  Top 0.152: v39.94,23.7 41.34,23.7 42.35,22.69 43.22,22.69 IC3.5
  Bottom 0.152: J6.2 39.41,24.23 v39.94,23.7
N$12  (via drill 0.3)
  Top 0.152: IC3.4 42.48,23.2 40.95,24.72 v40.57,24.72
  Bottom 0.152: J6.3 40.86,36.02 41.72,36.02 42.22,35.51 42.22,34.37 40.57,32.72 v40.57,24.72
N$13
  Top 0.152: Q6.3 J5.1
N$14
  Top 0.254: D2.A 13.64,21.43 13.27,21.8 13.27,22.43 13.05,22.65 C8.2
  Top 1.27: J7.2 9.55,22.65 C8.2
  pour Top (no thermals): 13.14,24.85 13.14,23.7 12.63,23.2 11.62,23.2 11.62,22.18 13.52,22.18 13.9,22.69 13.9,24.85
N$15
  Top 0.152: D2.C R12.1
N$16
  Top 0.152: U2.7 14.91,28.01 15.05,28.15 16.82,28.15 16.95,28.02 R12.2
N$17
  Top 0.254: R14.2 11.66,27.39 U2.10
N$18
  Top 0.152: Q5.3 39.39,37.88 40.06,38.56 40.06,47.49 J3.6
N$19
  Bottom 0.152: R15.2 R10.1 50.16,37.32 IC4.4
N$22  (via drill 0.35)
  Top 0.152: SJ1.2 47.94,34.37 48.32,34.75 v48.95,34.75
  Bottom 0.152: 52.06,34.24 52.06,33.99 51.81,33.74 49.46,33.74 48.95,34.24 v48.95,34.75 | 52.06,34.24 IC4.5 52.06,37.32 R10.2 | C6.1 52.1,34.21 52.06,34.24
N$23
  Top 0.152: R4.2 47.6,29.42 38.8,29.42 38.35,28.98 T1.1
N$24
  Top 0.152: R5.2 44.02,28.49 T2.1
N$25
  Top 0.152: C13.1 43.15,22.27 IC3.6
PHASE  (via drill 0.3)
  Top 0.152: IC2.6 24.57,24.21 24.82,24.47 26.22,24.47 26.79,25.04 26.79,27.2 25.84,28.15 25.84,36.66 v26.73,37.55 | v26.73,39.58 28.28,39.58 U1.30
  Bottom 0.152: v26.73,37.55 v26.73,39.58
REFLEX_EN
  Top 0.152: U1.28 48.95,37.09 49.41,36.63 49.41,35.84 48.95,35.39 46.67,35.39 46.41,35.13 SJ1.1 46.41,32.09 47.43,31.07 49.72,31.07 50.1,30.69 R13.2
REFLEX_SIG  (via drill 0.3)
  Top 0.152: U1.33 v29.78,43.44
  Bottom 0.152: v29.78,43.44 38.59,43.44 40.83,45.67 47.56,45.67 47.94,45.29 47.94,34.5 49.08,33.36 51.75,33.36 52.06,33.04 IC4.1
RTS
  Top 0.152: T2.2 | R4.1 T2.2 | T2.2 46.03,28.25 | IC3.24 46.03,25.85 46.29,26.12 46.29,28.12 T2.2
RXD  (via drill 0.3)
  Top 0.152: J4.4 8.19,50.5 19.19,50.5 24.39,45.3 27.74,45.3 U1.34 31.89,44.71 32.32,44.28 32.32,39.58 32.95,38.94 v39.3,38.94 | IC3.26 45.03,26.36 v44.51,26.88
  Bottom 0.152: v39.3,38.94 42.1,38.94 42.53,38.51 42.53,28.86 v44.51,26.88
SCL  (via drill 0.3)
  Top 0.152: v41.84,0.46 42.34,0.95 IC1.6 | R3.1 v40.45,14.94 | U1.36 30.21,47.25 v30.67,47.71 | 40.45,16.71 40.45,17.93 42.15,19.63 46.54,19.63 47.39,20.49 51.15,20.49 51.62,20.96 51.62,27.84 52.35,28.57 54.15,28.57 54.62,29.04 54.62,47.25 v54.16,47.71 | 40.45,16.46 40.45,16.71 | 40.45,16.71 v40.43,16.72
  Bottom 0.152: v41.84,0.46 42.35,0.97 42.35,13.04 v40.45,14.94 40.45,16.71 v40.43,16.72 | v30.67,47.71 v54.16,47.71
SD_CLK  (via drill 0.3)
  Top 0.152: U1.13 24.65,34.55 v24.7,34.5 | J3.5 v41.08,44.91
  Bottom 0.152: v24.7,34.5 25.54,33.66 29.78,33.66 41.03,44.91 v41.08,44.91
SD_CMD  (via drill 0.3)
  Top 0.152: R27.1 49.93,47.87 48.57,49.23 43.66,49.23 43.28,48.85 J3.3 43.24,47.54 v43.24,40.34 | U1.23 23.42,30.06 v24.57,28.91
  Bottom 0.152: v43.24,40.34 37.75,40.34 26.32,28.91 v24.57,28.91
SD_DATA0  (via drill 0.3)
  Top 0.152: R26.1 39.47,51.3 38.88,50.71 J3.7 38.92,47.54 v38.92,41.1 | U1.24 v24.69,30.06 v24.7,30.05
  Bottom 0.152: v38.92,41.1 38.08,41.1 27.03,30.05 v24.7,30.05
SD_DATA1  (via drill 0.3)
  Top 0.152: R25.1 38.2,54.73 37.78,54.31 J3.8 v37.78,42.63 | U1.26 29.7,34.55 v29.78,34.63
  Bottom 0.152: v29.78,34.63 v37.78,42.63
SD_DATA2  (via drill 0.3)
  Top 0.152: R29.1 46.12,41.01 45.53,41.61 v45.53,44.28 45.53,47.53 J3.1 | U1.14 24.62,33.28 v24.7,33.36
  Bottom 0.152: v24.7,33.36 29.91,33.36 40.83,44.28 v45.53,44.28
SD_DATA3
  Top 0.152: R28.1 50.52,46.14 47.94,48.72 44.63,48.72 44.38,48.47 J3.2
SD_PWR
  Top 0.152: U1.27 28.36,35.78 Q5.1
SDA  (via drill 0.3)
  Top 0.152: IC1.1 42.34,12.65 | 42.34,12.65 41.19,13.8 v40.32,13.8 | v34.6,14.94 R2.1 32.06,14.98 32.06,17.61 | U1.37 29.73,48.52 v29.78,48.47 | v42.99,12.65 42.34,12.65 | v45.14,16.59 47,18.44 47,19.66 47.52,20.18 51.28,20.18 51.93,20.83 51.93,27.72 52.43,28.23 54.24,28.23 54.92,28.91 v54.92,48.47
  Bottom 0.152: v40.32,13.8 35.75,13.8 v34.6,14.94 | v29.78,48.47 v54.92,48.47 | v45.14,16.59 42.99,14.43 v42.99,12.65
SPI_CLK  (via drill 0.3)
  Top 0.152: v23.43,35.9 9.71,35.9 U1.12
  Bottom 0.152: v23.43,35.9 23.43,28.4 23.72,28.11 28.55,28.11 J5.3
SPI_MOSI  (via drill 0.3)
  Top 0.152: v22.67,36.66 11.11,36.66 10.68,37.09 U1.11
  Bottom 0.152: v22.67,36.66 22.67,28.15 23.05,27.77 26.35,27.77 J5.4
TXD  (via drill 0.3)
  Top 0.152: J4.2 7.17,51.9 8.22,50.85 19.27,50.85 24.14,45.98 U1.35 32.27,45.98 32.7,45.55 32.7,40.21 33.15,39.76 v38.29,39.76 | IC3.25 v45.53,26.88
  Bottom 0.152: 43.24,29.16 v45.53,26.88 42.86,29.55 42.83,29.55 42.83,38.71 41.79,39.76 v38.29,39.76
V_BATT  (via drill 0.3, 0.35)
  Top 0.152: 41.34,1.22 IC1.5 41.34,1.37 v40.83,0.86 | 39.56,11.3 35.87,11.3 R8.2 34.48,11.3 | J3.4 42.18,39.88 42.9,39.16 v46.16,39.16 C7.1 51.96,39.16 52.38,39.58 52.38,42.75 | R25.2 52.04,56.43 52.38,56.09 52.38,53.17 | 52.38,53.17 52.38,49.61 | 52.38,49.61 52.38,44.53 | 52.38,44.53 52.38,42.75 | R26.2 51.53,53.17 52.38,53.17 | R27.2 52.34,49.57 52.38,49.61 | R29.2 52.34,42.71 52.38,42.75 | R28.2 52.3,44.44 52.38,44.53 | R11.2 30.79,28.4 J5.2 | R6.2 22.92,11.3 30.03,11.3 | U1.2 | SJ1.3 49.46,32.09 v49.08,31.7
  Top 0.254: v22.92,20.78 22.92,11.3 | R6.2 30.03,11.3 | 30.03,11.3 v33.08,11.3 34.48,11.3 | R8.2 39.56,11.3 40.41,11.3 v40.45,11.26 | 35.87,11.3 35.87,14.31 36.51,14.94 R3.2 37.31,15.61 37.78,16.08 41.76,16.08 42.13,15.71 v46.05,15.71 47.56,14.21 R9.2 | R2.2 30.03,14.65 30.03,11.3
  Top 0.508: v12.25,42.75 12.25,46.18 | 12.25,46.18 12.25,47.33 v11.11,48.47 11.06,48.52 U1.2 | 12.25,46.18 15.3,46.18 v15.43,46.06
  Bottom 0.152: 40.45,11.38 v40.45,11.26 40.45,2.49 40.79,2.15 C3.1 41.34,1.37 v40.83,0.86 | J5.2 v33.08,11.3 | R1.2 11.58,48.94 v11.11,48.47 | v49.08,31.7 48.95,31.58 48.07,31.58
  Bottom 0.254: v46.05,15.71 46.05,17.88 48.07,19.89 48.07,31.58 46.16,33.48 v46.16,39.16 46.16,39.2
  Bottom 0.508: C4.+ 8.94,39.44 v12.25,42.75 | v11.11,48.47 8.7,48.47 J4.6 | v15.43,46.06 14.66,45.29 R24.1
  Bottom 1.27: C4.+ 8.95,33.85 J1.2 8.95,24.97 11.62,22.31 v14.79,22.31 | v14.79,22.31 20.38,22.31 v21.9,20.78 v22.92,20.78 | v14.79,23.45 v14.79,22.31
  pour Top: 21.27,20.15 23.68,20.15 23.68,21.67 23.3,21.67 23.3,23.2 23.68,23.2 23.68,24.21 21.27,24.21
  pour Top (no thermals): 14.41,24.85 15.05,24.85 15.05,23.96 15.3,23.7 15.3,21.93 14.41,21.93

### Text on the board
tPlace: UART | MAX\!board V2.0 / 30.04.2018 | Micro SD | Display | - | - | Motor
bPlace: - | + | - | -